# Altium schematic sheet [06].FLASH.SchDoc
size A; Organization: Altium Limited; Address1: L3, 12a Rodborough Rd; Address2: Frenchs Forest; Address3: NSW; Address4: Australia 2086
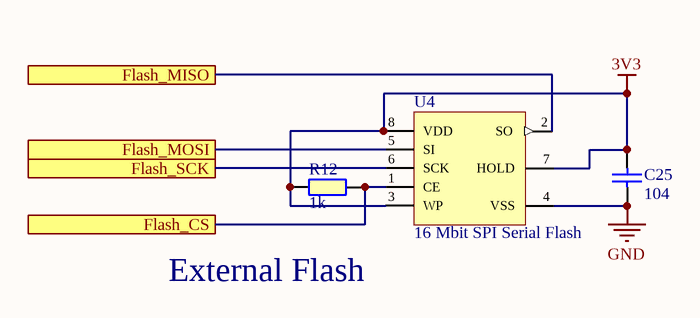
[diagram p0: [06].FLASH.SchDoc]

## Parts
C25  104  [C_0603]
R12  1k  [R_0603]
U4  16 Mbit SPI Serial Flash  [SST25]

## Ports
Flash_CS, Flash_MISO, Flash_MOSI, Flash_SCK

## Nets
3V3: C25.2 R12.1 U4.3(WP) U4.7(HOLD) U4.8(VDD)
GND: C25.1 U4.4(VSS)
Flash_CS: R12.2 U4.1(CE) ; port Flash_CS
Flash_MISO: U4.2(SO) ; port Flash_MISO
Flash_MOSI: U4.5(SI) ; port Flash_MOSI
Flash_SCK: U4.6(SCK) ; port Flash_SCK

## Notes on the sheet
- External Flash
- Title
- Size:
- Date:
- A
- Number:
- Time:
- Revision:
- Sheet
- of
- File:

## Library data of the parts
C25 = Cap SMD 0805: Capacitor SMD; Published: 8-Jun-2000; LatestRevisionDate: 17-Jul-2002; LatestRevisionNote: Re-released for DXP Platform.; PackageReference: RAD-0.3; Publisher: Altium Limited; Value: 104
R12 = RES_0805
U4 = SST25VF016B: MPN: SST25VF016B-50-4I-S2AF; OC_FARNELL: 1368695; OC_NEWARK: 82R4471; PACKAGE: SOIC-8; SUPPLIER: SILICON STORAGE TECHNOLOGY